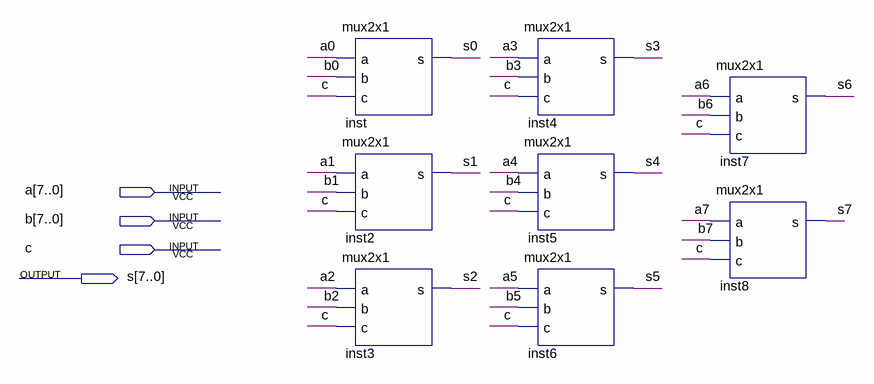
[diagram p0: schematic sheet]
// Quartus schematic mux2x1_8.bdf as structural Verilog: 8 symbols, 4 pins
module mux2x1_8 (
  input  [7:0] a,
  input  [7:0] b,
  input  c,
  output [7:0] s
);

  mux2x1 inst (.a(a[0]), .b(b[0]), .c(c), .s(s[0]));
  mux2x1 inst2 (.a(a[1]), .b(b[1]), .c(c), .s(s[1]));
  mux2x1 inst3 (.a(a[2]), .b(b[2]), .c(c), .s(s[2]));
  mux2x1 inst4 (.a(a[3]), .b(b[3]), .c(c), .s(s[3]));
  mux2x1 inst5 (.a(a[4]), .b(b[4]), .c(c), .s(s[4]));
  mux2x1 inst6 (.a(a[5]), .b(b[5]), .c(c), .s(s[5]));
  mux2x1 inst7 (.a(a[6]), .b(b[6]), .c(c), .s(s[6]));
  mux2x1 inst8 (.a(a[7]), .b(b[7]), .c(c), .s(s[7]));
endmodule
